# EAGLE design Controller (EAGLE 7.2.0)
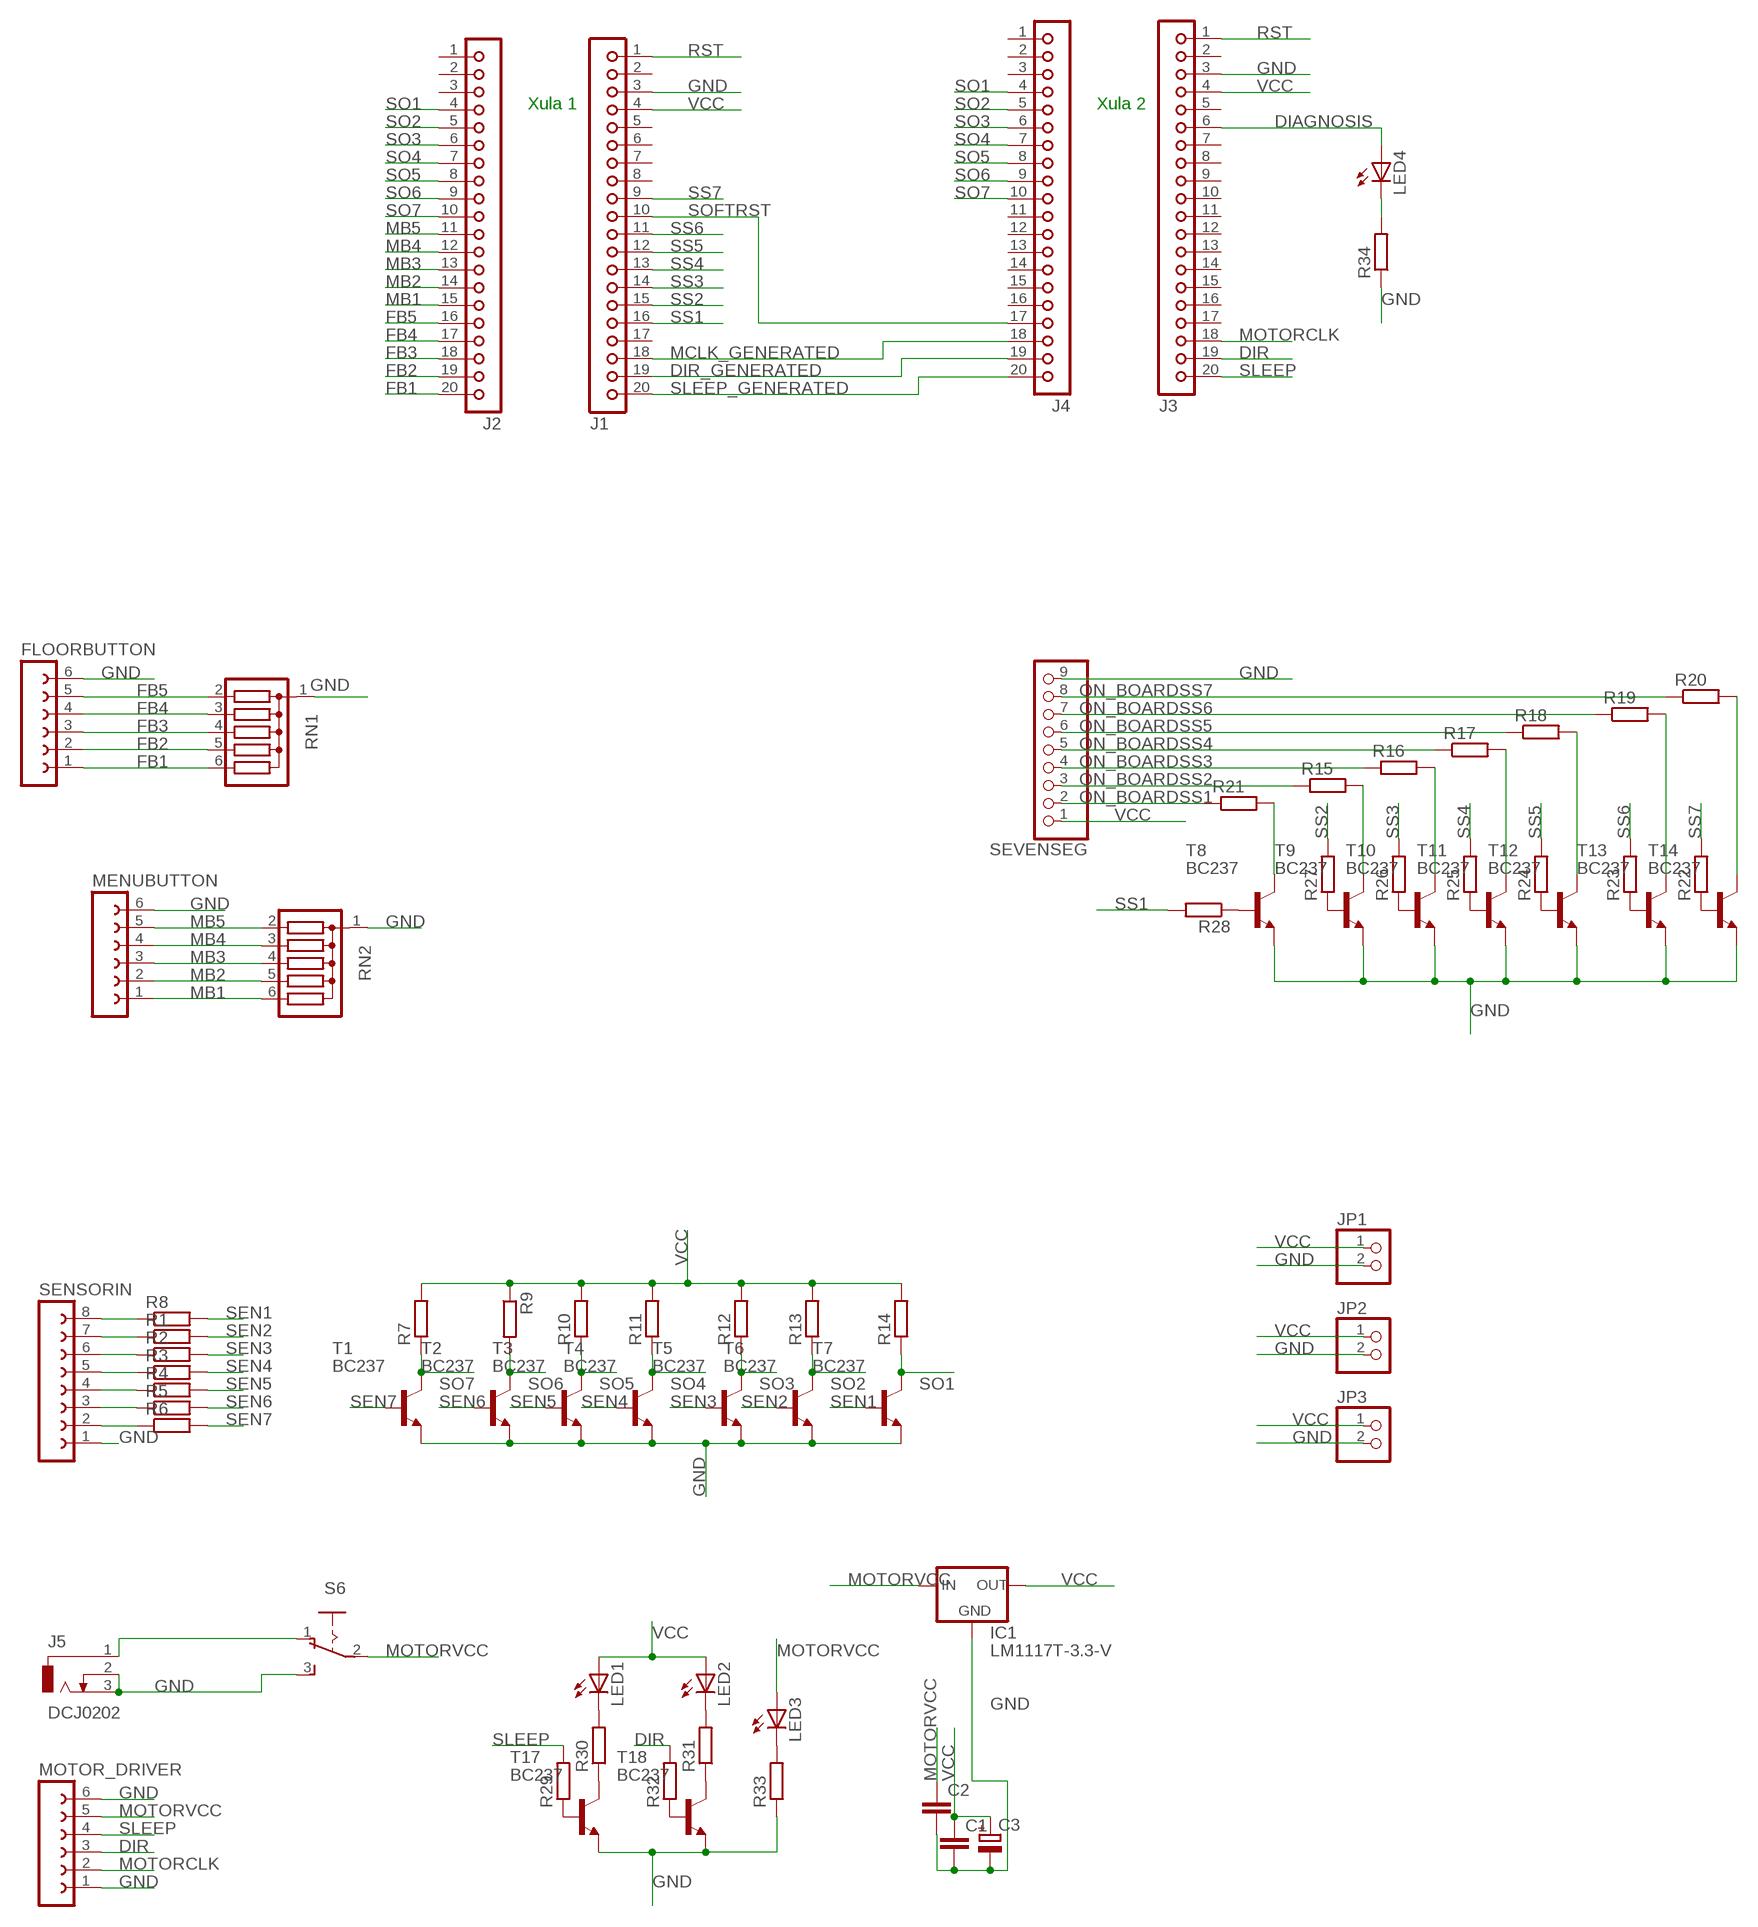
[diagram p0: schematic, sheet 1]

## Parts
C1  C-EU025-025X050  [C025-025X050]
C2  C-EU025-025X050  [C025-025X050]
C3  CPOL-EUE3.5-8  [E3,5-8]
FLOORBUTTON  FE06-1  [FE06]
IC1  LM1117T-3.3-V  [TO220V]
J1  JBK20  [JBK20]
J2  JBK20  [JBK20]
J3  JBK20  [JBK20]
J4  JBK20  [JBK20]
J5  DCJ0202  [DCJ0202]
JP1  PINHD-1X2  [1X02]
JP2  PINHD-1X2  [1X02]
JP3  PINHD-1X2  [1X02]
LED1  LED3MM  [LED3MM]
LED2  LED3MM  [LED3MM]
LED3  LED3MM  [LED3MM]
LED4  LED3MM  [LED3MM]
MENUBUTTON  FE06-1  [FE06]
MOTOR_DRIVER  FE06-1  [FE06]
R1  R-EU_0204/5  [0204/5]
R2  R-EU_0204/5  [0204/5]
R3  R-EU_0204/5  [0204/5]
R4  R-EU_0204/5  [0204/5]
R5  R-EU_0204/5  [0204/5]
R6  R-EU_0204/5  [0204/5]
R7  R-EU_0204/5  [0204/5]
R8  R-EU_0204/5  [0204/5]
R9  R-EU_0204/5  [0204/5]
R10  R-EU_0204/5  [0204/5]
R11  R-EU_0204/5  [0204/5]
R12  R-EU_0204/5  [0204/5]
R13  R-EU_0204/5  [0204/5]
R14  R-EU_0204/5  [0204/5]
R15  R-EU_0204/5  [0204/5]
R16  R-EU_0204/5  [0204/5]
R17  R-EU_0204/5  [0204/5]
R18  R-EU_0204/5  [0204/5]
R19  R-EU_0204/5  [0204/5]
R20  R-EU_0204/5  [0204/5]
R21  R-EU_0204/5  [0204/5]
R22  R-EU_0204/5  [0204/5]
R23  R-EU_0204/5  [0204/5]
R24  R-EU_0204/5  [0204/5]
R25  R-EU_0204/5  [0204/5]
R26  R-EU_0204/5  [0204/5]
R27  R-EU_0204/5  [0204/5]
R28  R-EU_0204/5  [0204/5]
R29  R-EU_0204/5  [0204/5]
R30  R-EU_0204/5  [0204/5]
R31  R-EU_0204/5  [0204/5]
R32  R-EU_0204/5  [0204/5]
R33  R-EU_0204/5  [0204/5]
R34  R-EU_0204/5  [0204/5]
RN1  G05R  [SIL6]
RN2  G05R  [SIL6]
S6  255SB  [255SB]
SENSORIN  FE08-1  [FE08]
SEVENSEG  PINHD-1X9  [1X09-BIG]
T1  BC237  [TO92]
T2  BC237  [TO92]
T3  BC237  [TO92]
T4  BC237  [TO92]
T5  BC237  [TO92]
T6  BC237  [TO92]
T7  BC237  [TO92]
T8  BC237  [TO92]
T9  BC237  [TO92]
T10  BC237  [TO92]
T11  BC237  [TO92]
T12  BC237  [TO92]
T13  BC237  [TO92]
T14  BC237  [TO92]
T17  BC237  [TO92]
T18  BC237  [TO92]

## Nets
DIAGNOSIS: J3.6 LED4.A
DIR: J3.19 MOTOR_DRIVER.3 R32.2
DIR_GENERATED: J1.19 J4.19
FB1: FLOORBUTTON.1 J2.20 RN1.6
FB2: FLOORBUTTON.2 J2.19 RN1.5
FB3: FLOORBUTTON.3 J2.18 RN1.4
FB4: FLOORBUTTON.4 J2.17 RN1.3
FB5: FLOORBUTTON.5 J2.16 RN1.2
GND: C1.2 C2.2 C3.- FLOORBUTTON.6 IC1.1(GND) J1.3 J3.3 J5.2 J5.3 JP1.2 JP2.2 JP3.2 MENUBUTTON.6 MOTOR_DRIVER.1 MOTOR_DRIVER.6 R33.1 R34.1 RN1.1 RN2.1 S6.3(S) SENSORIN.1 SEVENSEG.9 T1.1(E) T2.1(E) T3.1(E) T4.1(E) T5.1(E) T6.1(E) T7.1(E) T8.1(E) T9.1(E) T10.1(E) T11.1(E) T12.1(E) T13.1(E) T14.1(E) T17.1(E) T18.1(E)
MB1: J2.15 MENUBUTTON.1 RN2.6
MB2: J2.14 MENUBUTTON.2 RN2.5
MB3: J2.13 MENUBUTTON.3 RN2.4
MB4: J2.12 MENUBUTTON.4 RN2.3
MB5: J2.11 MENUBUTTON.5 RN2.2
MCLK_GENERATED: J1.18 J4.18
MOTORCLK: J3.18 MOTOR_DRIVER.2
MOTORVCC: C2.1 IC1.3(IN) LED3.A MOTOR_DRIVER.5 S6.2(P)
N$1: R2.1 SENSORIN.6
N$2: R21.2 T8.3(C)
N$3: LED4.K(C) R34.2
N$4: R15.2 T9.3(C)
N$5: R16.2 T10.3(C)
N$6: R17.2 T11.3(C)
N$7: R18.2 T12.3(C)
N$8: R19.2 T13.3(C)
N$9: R5.1 SENSORIN.3
N$10: R4.1 SENSORIN.4
N$11: R3.1 SENSORIN.5
N$12: R1.1 SENSORIN.7
N$13: R8.1 SENSORIN.8
N$14: R20.2 T14.3(C)
N$15: J5.1 S6.1(O)
N$16: R6.1 SENSORIN.2
N$28: R22.1 T14.2(B)
N$29: R23.1 T13.2(B)
N$30: R24.1 T12.2(B)
N$31: R25.1 T11.2(B)
N$32: R26.1 T10.2(B)
N$33: R27.1 T9.2(B)
N$34: R28.1 T8.2(B)
N$35: R29.1 T17.2(B)
N$36: R30.1 T17.3(C)
N$37: R31.1 T18.3(C)
N$38: R32.1 T18.2(B)
N$39: LED3.K(C) R33.2
N$40: LED1.K(C) R30.2
N$41: LED2.K(C) R31.2
ON_BOARDSS1: R21.1 SEVENSEG.2
ON_BOARDSS2: R15.1 SEVENSEG.3
ON_BOARDSS3: R16.1 SEVENSEG.4
ON_BOARDSS4: R17.1 SEVENSEG.5
ON_BOARDSS5: R18.1 SEVENSEG.6
ON_BOARDSS6: R19.1 SEVENSEG.7
ON_BOARDSS7: R20.1 SEVENSEG.8
RST: J1.1 J3.1
SEN1: R8.2 T7.2(B)
SEN2: R1.2 T6.2(B)
SEN3: R2.2 T5.2(B)
SEN4: R3.2 T4.2(B)
SEN5: R4.2 T3.2(B)
SEN6: R5.2 T2.2(B)
SEN7: R6.2 T1.2(B)
SLEEP: J3.20 MOTOR_DRIVER.4 R29.2
SLEEP_GENERATED: J1.20 J4.20
SO1: J2.4 J4.4 R14.1 T7.3(C)
SO2: J2.5 J4.5 R13.1 T6.3(C)
SO3: J2.6 J4.6 R12.1 T5.3(C)
SO4: J2.7 J4.7 R11.1 T4.3(C)
SO5: J2.8 J4.8 R10.1 T3.3(C)
SO6: J2.9 J4.9 R9.2 T2.3(C)
SO7: J2.10 J4.10 R7.1 T1.3(C)
SOFTRST: J1.10 J4.17
SS1: J1.16 R28.2
SS2: J1.15 R27.2
SS3: J1.14 R26.2
SS4: J1.13 R25.2
SS5: J1.12 R24.2
SS6: J1.11 R23.2
SS7: J1.9 R22.2
VCC: C1.1 C3.+ IC1.2(OUT) J1.4 J3.4 JP1.1 JP2.1 JP3.1 LED1.A LED2.A R7.2 R9.1 R10.2 R11.2 R12.2 R13.2 R14.2 SEVENSEG.1
Unconnected: J1.2 J1.5 J1.6 J1.7 J1.8 J1.17 J2.1 J2.2 J2.3 J3.2 J3.5 J3.7 J3.8 J3.9 J3.10 J3.11 J3.12 J3.13 J3.14 J3.15 J3.16 J3.17 J4.1 J4.2 J4.3 J4.11 J4.12 J4.13 J4.14 J4.15 J4.16

## Notes on the sheet
- Xula 1 | Xula 2

## Library data of the parts
C1 C2 = rcl:C-EU: CAPACITOR, European symbol
C3 = rcl:CPOL-EU: POLARIZED CAPACITOR, European symbol
FLOORBUTTON MENUBUTTON MOTOR_DRIVER = con-lsta:FE06-1: FEMALE HEADER; OC_FARNELL: unknown; OC_NEWARK: unknown
IC1 = lm1117:LM1117T-*
J1-J4 = con-lsta:JBK20: PIN HEADER; OC_FARNELL: unknown; OC_NEWARK: unknown
J5 = con-jack:DCJ0202: DC POWER JACK Source: DCJ0202.pdf; OC_FARNELL: unknown; OC_NEWARK: unknown
JP1-JP3 = pinhead:PINHD-1X2: PIN HEADER
LED1-LED4 = led:LED: LED OSRAM: - CHIPLED LG R971, LG N971, LY N971, LG Q971, LY Q971, LO R971, LY R971 LH N974, LH R974 LS Q976, LO Q976, LY Q976 LO Q996 - Hyper CHIPLED LW Q18S LB Q993, LB Q99A, LB R99A - SideLED LS A670, LO A670, LY A670, LG A670, LP A670 LB A673, LV A673, LT A673, LW A673 LH A674 LY A675 LS A676, LA A676, LO A676, LY A676, LW A676 LS A679, LY A679, LG A679 - Hyper Micro SIDELED® LS Y876, LA Y876, LO Y876, LY Y876 LT Y87S - SmartLED LW L88C, LW L88S LB L89C, LB L89S, LG L890 LS L89K, LO L89K, LY L89K LS L896, LA L896, LO L896, LY L896 - TOPLED LS T670, LO T670, LY T670, LG T670, LP T670 LSG T670, LSP T670, LSY T670, LOP T670, LYG T670 LG T671, LOG T671, LSG T671 LB T673, LV T673, LT T673, LW T673 LH T674 LS T676, LA T676, LO T676, LY T676, LB T676, LH T676, LSB T676, LW T676 LB T67C, LV T67C, LT T67C, LS T67K, LO T67K, LY T67K, LW E67C LS E67B, LA E67B, LO E67B, LY E67B, LB E67C, LV E67C, LT E67C LW T67C LS T679, LY T679, LG T679 LS T770, LO T770, LY T770, LG T770, LP T770 LB T773, LV T773, LT T773, LW T773 LH T774 LS E675, LA E675, LY E675, LS T675 LS T776, LA T776, LO T776, LY T776, LB T776 LHGB T686 LT T68C, LB T68C - Hyper Mini TOPLED® LB M676 - Mini TOPLED Santana® LG M470 LS M47K, LO M47K, LY M47K Source: http://www.osram.convergy.de LUXEON: - LUMILED® LXK2-PW12-R00, LXK2-PW12-S00, LXK2-PW14-U00, LXK2-PW14-V00 LXK2-PM12-R00, LXK2-PM12-S00, LXK2-PM14-U00 LXK2-PE12-Q00, LXK2-PE12-R00, LXK2-PE12-S00, LXK2-PE14-T00, LXK2-PE14-U00 LXK2-PB12-K00, LXK2-PB12-L00, LXK2-PB12-M00, LXK2-PB14-N00, LXK2-PB14-P00, LXK2-PB14-Q00 LXK2-PR12-L00, LXK2-PR12-M00, LXK2-PR14-Q00, LXK2-PR14-R00 LXK2-PD12-Q00, LXK2-PD12-R00, LXK2-PD12-S00 LXK2-PH12-R00, LXK2-PH12-S00 LXK2-PL12-P00, LXK2-PL12-Q00, LXK2-PL12-R00 Source: www.luxeon.com KINGBRIGHT: KA-3528ASYC Source: www.kingbright.com
R1-R34 = rcl:R-EU_: RESISTOR, European symbol
RN1 RN2 = resistor-sil:G05R: SIL RESISTOR; OC_FARNELL: unknown; OC_NEWARK: unknown
S6 = switch:255SB: SLIDING SWITCH Distributor Buerklin, 11G810
SENSORIN = con-lsta:FE08-1: FEMALE HEADER; OC_FARNELL: unknown; OC_NEWARK: unknown
SEVENSEG = adafruit:PINHD-1X9: Pin header 1x10 0.1" spacing With round pins
T1-T14 T17 T18 = transistor-neu-to92:BC237: NPN TRANSISTOR

## Net classes
0 default: clearance 0.205 mm

## Board
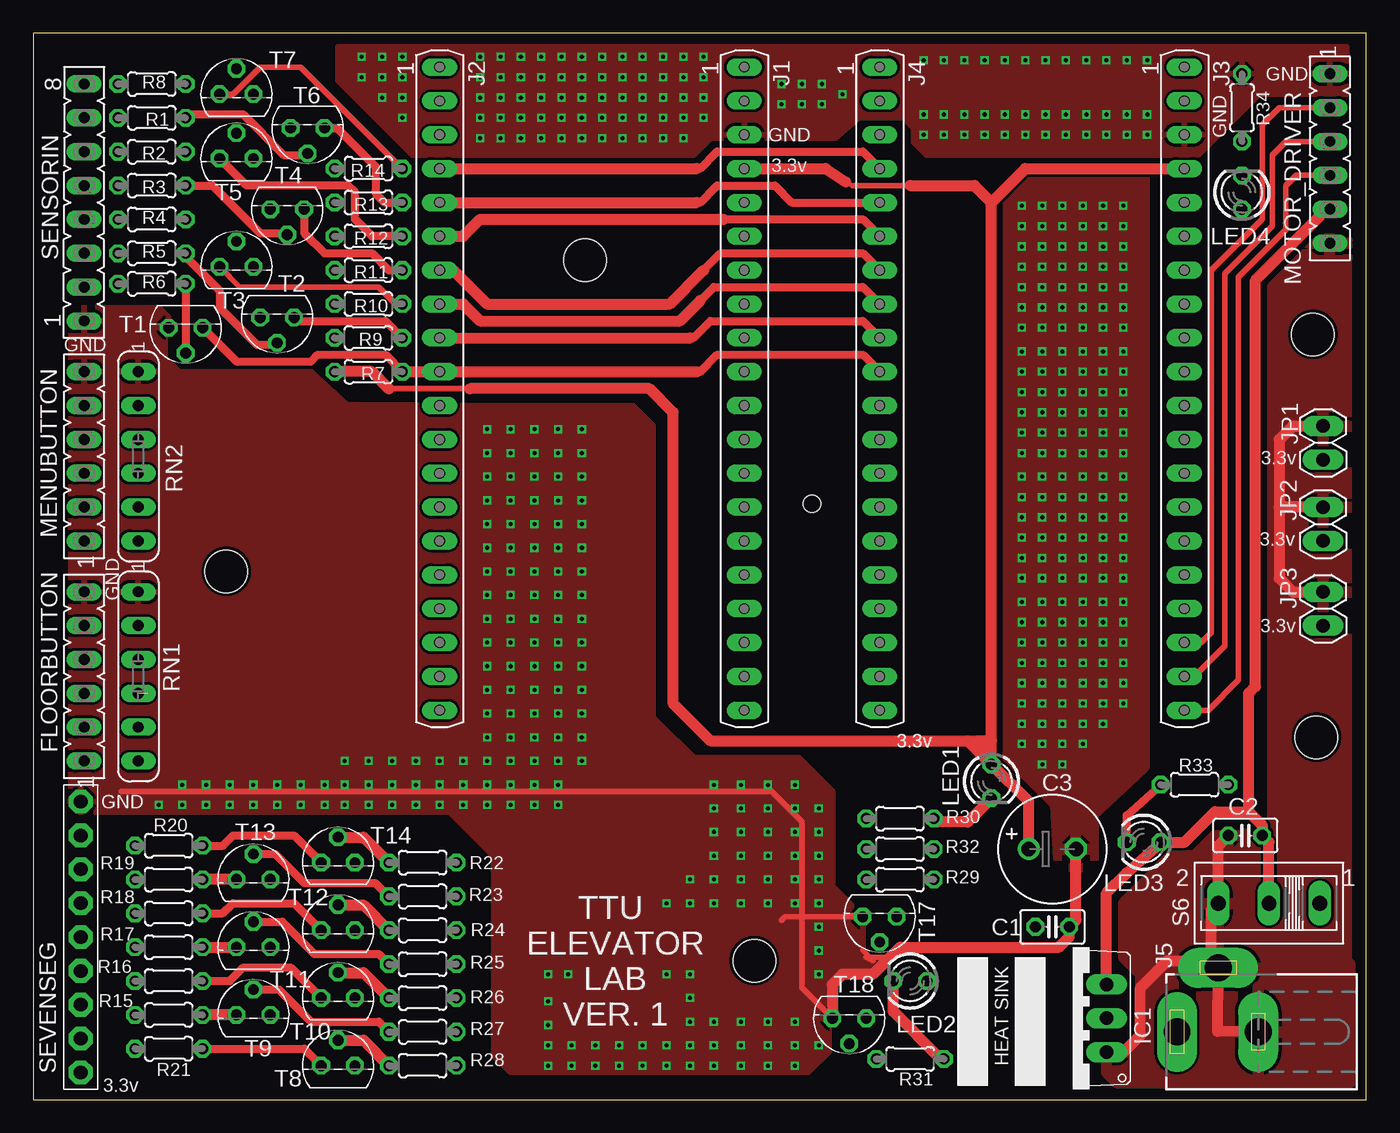
[diagram p1: board, top side]
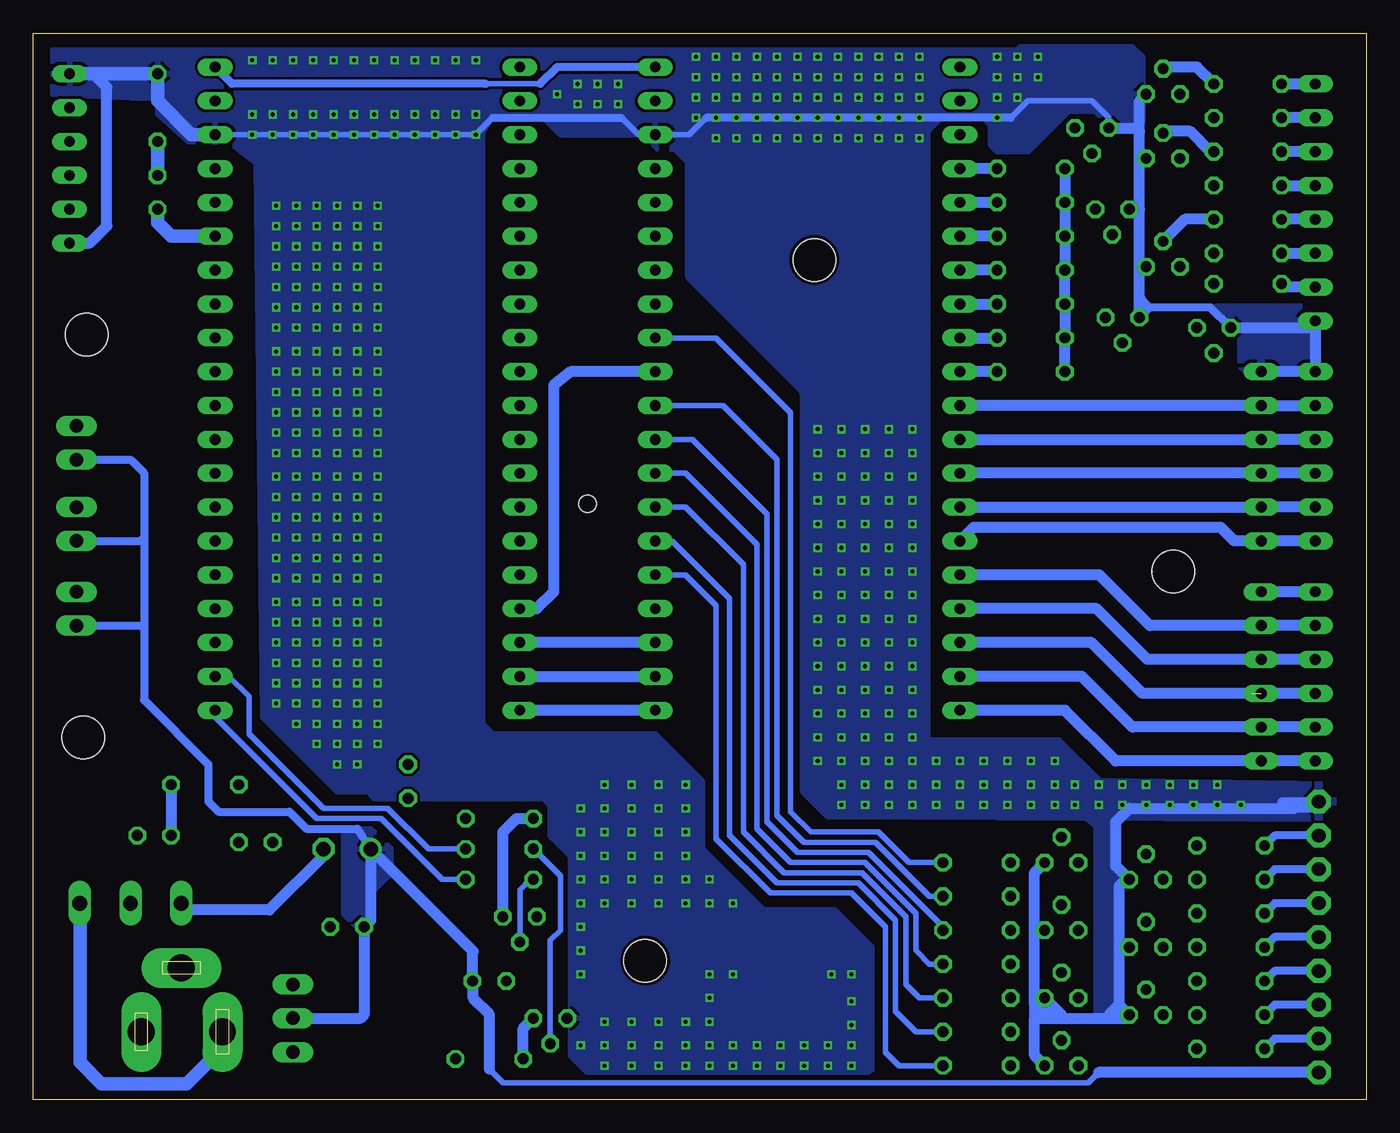
[diagram p2: board, bottom side, seen from below]

Size 100 x 80 mm. Coordinates in mm from the lower left corner, seen from the top.
Outline: 0,0 100,0 100,80 0,80 0,0
Copper layers (1*16): Top 0.035mm / dielectric 1.5mm / Bottom 0.035mm
Design rules "SeeedStudio_2layer_DRU_no_angle_20140221": minimum track width 6mil, minimum drill 12mil, track to track 6mil, track to pad 6mil, pad to pad 6mil, via to via 6mil, smd to smd 0mil, copper to edge 10mil, drill to drill 10mil, minimum pad ring 10mil, minimum via ring 6mil, stop-mask expansion 2mil, vias tented up to drill 100mil, thermal gap 10mil
Holes 3.2 mm at 96.01,57.4 96.27,27.18 14.48,39.62 41.4,62.99 54.1,10.41
Holes 1.3 mm at 58.42,44.7

### Footprints (pad centres in the part's own frame; a part is rotated, then mirrored left to right if it is on the bottom)
C025-025X050 = drill 0.813 octagon: 1 -1.27,0; 2 1.27,0
E3,5-8 = drill 1.1 pad 1.6: + -1.778,0 | drill 1.1 pad 1.6 octagon: - 1.778,0
FE06 = drill 0.813 long: 1 -6.35,0; 2 -3.81,0; 3 -1.27,0; 4 1.27,0; 5 3.81,0; 6 6.35,0
TO220V = drill 1.016 long: 1 -2.54,-2.54; 2 0,-2.54; 3 2.54,-2.54
JBK20 = drill 0.813 long: 1 -24.13,0; 2 -21.59,0; 3 -19.05,0; 4 -16.51,0; 5 -13.97,0; 6 -11.43,0; 7 -8.89,0; 8 -6.35,0; 9 -3.81,0; 10 -1.27,0; 11 1.27,0; 12 3.81,0; 13 6.35,0; 14 8.89,0; 15 11.43,0; 16 13.97,0; 17 16.51,0; 18 19.05,0; 19 21.59,0; 20 24.13,0
DCJ0202 = drill 2 pad 2 long: 1 0,3.1; 2 4.8,0; 3 0,-3
1X02 = drill 1.016 long: 1 -1.27,0; 2 1.27,0
LED3MM = drill 0.813 octagon: A -1.27,0; K 1.27,0
0204/5 = drill 0.813 octagon: 1 -2.54,0; 2 2.54,0
SIL6 = drill 0.813 long: 1 -6.35,0; 2 -3.81,0; 3 -1.27,0; 4 1.27,0; 5 3.81,0; 6 6.35,0
255SB = drill 1.118 long: 1 -3.81,0; 2 0,0; 3 3.81,0
FE08 = drill 0.813 long: 1 -8.89,0; 2 -6.35,0; 3 -3.81,0; 4 -1.27,0; 5 1.27,0; 6 3.81,0; 7 6.35,0; 8 8.89,0
1X09-BIG = drill 1.016 pad 1.778 octagon: 1 -10.16,0; 2 -7.62,0; 3 -5.08,0; 4 -2.54,0; 5 0,0; 6 2.54,0; 7 5.08,0; 8 7.62,0; 9 10.16,0
TO92 = drill 0.813 octagon: 1 1.27,0; 2 0,1.905; 3 -1.27,0

### Placement (x,y rotation side)
C1  76.45,12.95 0 top
C2  90.93,19.81 180 top
C3  76.45,18.8 0 top
FLOORBUTTON  3.81,31.75 90 top
IC1  77.98,6.1 90 top
J1  53.34,53.34 270 top
J2  30.48,53.34 270 top
J3  86.36,53.34 270 top
J4  63.5,53.34 270 top
J5  88.9,5.08 90 top
JP1  96.77,49.28 90 top
JP2  96.77,43.18 90 top
JP3  96.77,36.83 90 top
LED1  71.88,23.88 270 top
LED2  65.79,8.89 180 top
LED3  83.31,19.3 180 top
LED4  90.68,68.07 90 top
MENUBUTTON  3.81,48.26 90 top
MOTOR_DRIVER  97.28,70.61 270 top
R1  8.89,73.66 0 top
R2  8.89,71.12 0 top
R3  8.89,68.58 0 top
R4  8.89,66.04 0 top
R5  8.89,63.5 0 top
R6  8.89,61.21 0 top
R7  25.15,54.61 180 top
R8  8.89,76.2 0 top
R9  25.15,57.15 0 top
R10  25.15,59.69 180 top
R11  25.15,62.23 180 top
R12  25.15,64.77 180 top
R13  25.15,67.31 180 top
R14  25.15,69.85 180 top
R15  10.16,6.35 0 top
R16  10.16,8.89 0 top
R17  10.16,11.43 0 top
R18  10.16,13.97 0 top
R19  10.16,16.51 0 top
R20  10.16,19.05 0 top
R21  10.16,3.81 0 top
R22  29.21,17.78 0 top
R23  29.21,15.24 0 top
R24  29.21,12.7 0 top
R25  29.21,10.16 0 top
R26  29.21,7.62 0 top
R27  29.21,5.08 0 top
R28  29.21,2.54 0 top
R29  65.02,16.51 0 top
R30  65.02,21.08 0 top
R31  65.79,3.05 0 top
R32  65.02,18.8 0 top
R33  87.12,23.62 180 top
R34  90.68,74.42 270 top
RN1  7.87,31.75 270 top
RN2  7.87,48.26 270 top
S6  92.71,14.73 180 top
SENSORIN  3.81,67.31 90 top
SEVENSEG  3.56,12.19 90 top
T1  11.43,57.91 180 top
T2  18.29,58.67 180 top
T3  15.24,62.48 0 top
T4  19.05,66.8 180 top
T5  15.24,70.61 0 top
T6  20.57,72.9 180 top
T7  15.24,75.44 0 top
T8  22.86,2.54 0 top
T9  16.51,6.35 0 top
T10  22.86,7.62 0 top
T11  16.51,11.43 0 top
T12  22.86,12.7 0 top
T13  16.51,16.51 0 top
T14  22.86,17.78 0 top
T17  63.5,13.72 180 top
T18  61.21,6.1 180 top

### Tracks (layer width: path | path; a pad name or v marks a point on that pad's centre or on a via)
DIAGNOSIS
  Bottom 1.016: LED4.A 90.68,65.79 89.66,64.77 J3.6
DIR
  Top 0.406: J3.19 87.12,31.75 89.41,34.04 89.41,61.98 92.96,65.53 92.96,70.87 93.98,71.88 MOTOR_DRIVER.3
  Bottom 0.406: R32.2 70.36,18.8 73.41,21.84 78.23,21.84 83.82,27.43 83.82,30.23 85.34,31.75 J3.19
DIR_GENERATED
  Bottom 0.813: J4.19 J1.19
FB1
  Bottom 0.813: FLOORBUTTON.1 RN1.6 18.8,25.4 22.61,29.21 J2.20
FB2
  Bottom 0.813: FLOORBUTTON.2 RN1.5 17.53,27.94 21.34,31.75 J2.19
FB3  (1 unrouted)
  Bottom 0.813: FLOORBUTTON.3 RN1.4 | RN1.4 8.64,30.48 | RN1.4 16.8,30.48 20.61,34.29 J2.18
FB4
  Bottom 0.813: FLOORBUTTON.4 RN1.3 16.43,33.02 20.24,36.83 J2.17
FB5
  Bottom 0.813: FLOORBUTTON.5 RN1.2 16.22,35.56 20.03,39.37 J2.16
GND  (via drill 0.3)
  Top 0.406: 62.23,11.18 62.99,10.41 62.48,10.67 64.26,10.67 | 6.6,23.11 55.37,23.11 57.66,20.83 57.66,8.38 T18.1 | T17.1 56.39,13.72 56.13,13.46
  Top 0.813: J5.3 88.85,5.1 J5.2 88.37,10.41 | C2.2 88.9,19.05 S6.3 88.37,14.2 88.37,10.41 | T18.1 59.94,8.64 60.71,9.4 62.99,9.4 64.26,10.67 65.02,11.43 76.96,11.43 77.72,12.19 C1.2 78.23,13.46 C3.- | IC1.1 81.79,3.56 83.06,4.83 83.06,8.38 85.09,10.41 88.37,10.41 | 93.47,44.45 93.47,49.53 94.49,50.55 JP1.2 | 93.47,44.45 93.47,39.12 94.49,38.1 JP3.2 | JP2.2 93.47,44.45
  Bottom 0.406: 65.53,73.66 v66.8,72.39 J3.3 | 55.88,73.66 54.61,72.39 J1.3 50.8,72.39 49.53,73.66 | T6.1 19.3,73.66 20.57,74.93 25.4,74.93 26.67,73.66
  Bottom 0.61: T1.1 11.68,59.44 16.26,59.44 | 16.26,59.44 T2.1 | 65.53,73.66 55.88,73.66 | 26.67,73.66 49.53,73.66 | 16.26,59.44 17.02,60.2 | 6.35,22.35 SEVENSEG.9 4.06,21.84 6.35,21.84
  Bottom 0.813: FLOORBUTTON.6 RN1.1 | RN2.1 MENUBUTTON.6 SENSORIN.1 4.32,57.91 T1.1 | 18.54,11.43 18.54,16 18.03,16.51 T13.1 18.8,17.53 18.8,20.83 17.78,21.84 6.35,21.84 5.33,21.84 | 18.54,11.43 18.54,7.11 | T11.1 18.54,11.43 | T8.1 24.89,3.3 24.89,6.1 | 24.89,7.11 24.89,7.37 | 24.89,7.37 24.89,12.45 | 24.89,12.45 24.89,17.02 T14.1 | T12.1 24.64,12.7 24.89,12.45 | 24.38,7.62 24.64,7.62 24.89,7.37 | T9.1 19.3,6.35 18.54,7.11 | 24.38,7.62 24.89,7.11 | 24.89,7.11 24.89,6.1 | 24.89,6.1 18.03,6.1 T9.1 | T9.1 18.54,7.11 | 24.38,6.35 24.38,7.11 23.62,6.35 22.86,6.35 T10.1 24.38,7.62 | T2.1 17.02,60.2 17.02,62.48 | 17.02,62.48 17.02,66.8 | 17.02,66.8 17.02,70.61 | 17.02,70.61 17.02,72.64 | 17.02,72.64 17.02,74.93 T7.1 | T5.1 17.02,70.61 | T4.1 17.02,66.8 | T3.1 17.02,62.48 | T6.1 17.27,72.9 17.02,72.64 | R33.1 C2.2 | C3.- 78.23,18.29 82.3,14.22 88.39,14.22 S6.3 | MOTOR_DRIVER.6 95.76,64.26 94.49,65.53 94.49,75.95 95.5,76.96
  Bottom 1.016: J3.3 88.14,72.39 90.68,74.93 R34.1 95.5,76.96 MOTOR_DRIVER.1
  other vias: 80.26,65.53 81.79,65.53 78.74,65.53 77.22,65.53 75.69,65.53 74.17,65.53 81.79,62.48 80.26,62.48 78.74,62.48 77.22,62.48 75.69,62.48 74.17,62.48 80.26,64.01 81.79,64.01 78.74,64.01 77.22,64.01 75.69,64.01 74.17,64.01 34.04,50.29 35.81,50.29 37.59,50.29 39.37,50.29 41.15,50.29 34.04,23.62 35.81,23.62 37.59,23.62 39.37,23.62 51.05,23.62 53.09,23.62 55.12,23.62 57.15,23.62 51.05,21.84 53.09,21.84 55.12,21.84 57.15,21.84 58.93,21.84 58.93,20.07 57.15,20.07 55.12,20.07 53.09,20.07 51.05,20.07 51.05,18.29 53.09,18.29 55.12,18.29 57.15,18.29 58.93,18.29 58.93,16.51 57.15,16.51 55.12,16.51 53.09,16.51 51.05,16.51 58.93,14.73 58.93,12.95 57.15,14.73 58.93,11.18 58.93,9.4 55.12,14.73 53.09,14.73 51.05,14.73 34.04,48.51 35.81,48.51 37.59,48.51 39.37,48.51 41.15,48.51 34.04,46.74 35.81,46.74 37.59,46.74 39.37,46.74 41.15,46.74 34.04,44.96 35.81,44.96 37.59,44.96 39.37,44.96 41.15,44.96 34.04,43.18 35.81,43.18 37.59,43.18 39.37,43.18 41.15,43.18 34.04,41.4 35.81,41.4 37.59,41.4 39.37,41.4 41.15,41.4 34.04,39.62 35.81,39.62 37.59,39.62 39.37,39.62 41.15,39.62 34.04,25.4 35.81,25.4 37.59,25.4 39.37,25.4 41.15,25.4 34.04,27.18 35.81,27.18 37.59,27.18 39.37,27.18 41.15,27.18 34.04,28.96 35.81,28.96 37.59,28.96 39.37,28.96 41.15,28.96 34.04,30.73 35.81,30.73 37.59,30.73 39.37,30.73 41.15,30.73 34.04,32.51 35.81,32.51 37.59,32.51 39.37,32.51 41.15,32.51 34.04,36.07 35.81,36.07 37.59,36.07 39.37,36.07 41.15,36.07 34.04,37.85 35.81,37.85 37.59,37.85 39.37,37.85 41.15,37.85 34.04,34.29 35.81,34.29 37.59,34.29 39.37,34.29 41.15,34.29 32.26,22.1 34.04,22.1 35.81,22.1 37.59,22.1 39.37,22.1 32.26,23.62 23.37,23.62 25.15,23.62 26.92,23.62 28.7,23.62 30.48,23.62 30.48,22.1 28.7,22.1 26.92,22.1 25.15,22.1 23.37,22.1 53.09,5.84 55.12,5.84 57.15,5.84 57.15,4.06 55.12,4.06 53.09,4.06 57.15,2.54 55.12,2.54 53.09,2.54 51.05,5.84 51.05,4.06 51.05,2.54 49.28,4.06 47.5,4.06 45.72,4.06 43.94,4.06 42.16,4.06 40.39,4.06 38.61,4.06 38.61,5.59 38.61,2.54 40.39,2.54 42.16,2.54 43.94,2.54 45.72,2.54 47.5,2.54 49.28,2.54 49.28,5.84 49.28,7.62 49.28,16.51 49.28,14.73 47.5,14.73 49.28,9.4 47.5,9.4 38.61,7.37 38.61,9.4 40.13,9.4 32.26,25.4 30.48,25.4 28.7,25.4 26.92,25.4 25.15,25.4 23.37,25.4 21.84,23.62 21.84,22.1 58.93,4.06 81.79,29.72 80.26,29.72 78.74,29.72 77.22,29.72 75.69,29.72 74.17,29.72 80.26,28.19 78.74,28.19 77.22,28.19 75.69,28.19 74.17,28.19 74.17,26.67 75.69,26.67 77.22,26.67 78.74,26.67 77.22,25.15 75.69,25.15 74.17,67.06 80.26,31.24 81.79,31.24 78.74,31.24 77.22,31.24 75.69,31.24 74.17,31.24 80.26,32.77 81.79,32.77 78.74,32.77 77.22,32.77 75.69,32.77 74.17,32.77 81.79,34.29 80.26,34.29 78.74,34.29 77.22,34.29 75.69,34.29 74.17,34.29 80.26,35.81 81.79,35.81 78.74,35.81 77.22,35.81 75.69,35.81 74.17,35.81 80.26,37.34 81.79,37.34 78.74,37.34 77.22,37.34 75.69,37.34 74.17,37.34 81.79,39.12 80.26,39.12 78.74,39.12 77.22,39.12 75.69,39.12 74.17,39.12 80.26,40.64 81.79,40.64 78.74,40.64 77.22,40.64 75.69,40.64 74.17,40.64 80.26,42.16 81.79,42.16 78.74,42.16 77.22,42.16 75.69,42.16 74.17,42.16 81.79,43.69 80.26,43.69 78.74,43.69 77.22,43.69 75.69,43.69 74.17,43.69 80.26,45.21 81.79,45.21 78.74,45.21 77.22,45.21 75.69,45.21 74.17,45.21 80.26,46.74 81.79,46.74 78.74,46.74 77.22,46.74 75.69,46.74 74.17,46.74 81.79,48.51 80.26,48.51 78.74,48.51 77.22,48.51 75.69,48.51 74.17,48.51 80.26,50.04 81.79,50.04 78.74,50.04 77.22,50.04 75.69,50.04 74.17,50.04 80.26,51.56 81.79,51.56 78.74,51.56 77.22,51.56 75.69,51.56 74.17,51.56 81.79,53.09 80.26,53.09 78.74,53.09 77.22,53.09 75.69,53.09 74.17,53.09 80.26,54.61 81.79,54.61 78.74,54.61 77.22,54.61 75.69,54.61 74.17,54.61 80.26,56.13 81.79,56.13 78.74,56.13 77.22,56.13 75.69,56.13 74.17,56.13 81.79,57.91 80.26,57.91 78.74,57.91 77.22,57.91 75.69,57.91 74.17,57.91 80.26,59.44 81.79,59.44 78.74,59.44 77.22,59.44 75.69,59.44 74.17,59.44 80.26,60.96 81.79,60.96 78.74,60.96 77.22,60.96 75.69,60.96 74.17,60.96 75.69,67.06 77.22,67.06 78.74,67.06 80.26,67.06 81.79,67.06 82.04,72.39 80.52,72.39 78.99,72.39 77.47,72.39 75.95,72.39 74.42,72.39 72.9,72.39 71.37,72.39 69.85,72.39 68.33,72.39 83.57,72.39 77.47,73.91 78.99,73.91 80.52,73.91 82.04,73.91 83.57,73.91 75.95,73.91 74.42,73.91 72.9,73.91 71.37,73.91 69.85,73.91 68.33,73.91 66.8,73.91 68.33,77.98 66.8,77.98 69.85,77.98 71.37,77.98 72.9,77.98 74.42,77.98 75.95,77.98 77.47,77.98 78.99,77.98 80.52,77.98 82.04,77.98 83.57,77.98 33.53,78.23 35.05,78.23 36.58,78.23 38.1,78.23 39.62,78.23 41.15,78.23 42.67,78.23 44.2,78.23 45.72,78.23 47.24,78.23 48.77,78.23 50.29,78.23 27.69,78.23 26.16,78.23 24.64,78.23 24.64,76.71 26.16,76.71 27.69,76.71 27.69,75.18 26.16,75.18 27.69,73.66 33.53,73.66 35.05,73.66 36.58,73.66 38.1,73.66 39.62,73.66 41.15,73.66 42.67,73.66 44.2,73.66 45.72,73.66 47.24,73.66 48.77,73.66 50.29,73.66 33.53,72.14 35.05,72.14 36.58,72.14 38.1,72.14 39.62,72.14 41.15,72.14 42.67,72.14 44.2,72.14 45.72,72.14 47.24,72.14 48.77,72.14 56.13,76.2 57.66,76.2 59.18,76.2 59.18,74.68 57.66,74.68 56.13,74.68 60.71,75.44 33.53,75.18 35.05,75.18 36.58,75.18 38.1,75.18 39.62,75.18 41.15,75.18 42.67,75.18 44.2,75.18 45.72,75.18 47.24,75.18 48.77,75.18 50.29,75.18 33.53,76.71 35.05,76.71 36.58,76.71 38.1,76.71 39.62,76.71 41.15,76.71 42.67,76.71 44.2,76.71 45.72,76.71 47.24,76.71 48.77,76.71 50.29,76.71 20.07,22.1 18.29,22.1 16.51,22.1 14.73,22.1 12.95,22.1 11.18,22.1 9.4,22.1 11.18,23.62 12.95,23.62 14.73,23.62 16.51,23.62 18.29,23.62 20.07,23.62
  pour Bottom: 57.15,7.11 57.15,18.29 61.72,22.86 74.42,22.86 74.93,23.37 77.22,23.37 82.8,28.96 83.31,73.66 82.3,74.68 67.56,74.68 66.29,73.41 66.29,28.19 65.53,27.43 53.34,27.43 50.8,24.89 50.8,11.94 56.64,6.1 59.69,6.1
  pour Top: 3.3,21.59 31.24,21.59 34.54,18.29 34.54,3.3 35.81,2.03 58.17,2.03 59.69,3.56 59.69,6.35 57.66,8.38 57.66,20.83 55.37,23.11 3.3,23.11
  pour Top: 2.79,21.59 2.79,52.32 33.02,52.07 33.53,44.2 33.27,26.67 33.53,25.65 36.83,22.35 9.4,22.35 8.64,21.59
  pour Bottom: 3.81,58.42 4.83,59.44 11.18,59.44 11.43,59.18 10.16,57.91 9.4,57.15 9.4,55.12 8.89,54.61 3.81,54.61
  pour Bottom: 16.76,75.44 16.76,78.23 17.53,78.99 19.56,78.99 25.91,78.99 28.7,76.2 28.7,73.66 28.19,73.15 28.19,71.63 27.69,71.12 25.4,71.12 22.35,74.17 21.34,74.17 20.32,74.17 19.56,73.41 19.56,72.9 17.27,72.9 16.76,73.41
  pour Bottom: 32,73.66 33.02,72.64 33.02,26.92 23.11,26.92 20.07,23.88 2.54,23.62 2.54,21.08 40.39,21.34 42.16,23.11 42.16,53.09 50.8,61.72 50.8,70.36 51.82,71.37 53.09,71.37 53.34,71.63 53.34,72.39 52.58,73.15 50.29,73.15 49.78,73.66
  pour Bottom: 65.53,73.66 66.8,74.93 82.8,75.18 85.6,72.39 86.11,72.39 83.06,70.1 68.07,71.12
  pour Bottom: 59.69,3.3 59.69,18.29 61.21,19.81 61.21,25.91 59.94,27.18 53.09,27.18 49.78,23.88 49.78,18.8 45.21,14.22 39.88,14.22 37.08,11.43 37.08,2.29 37.34,2.03 58.42,2.03
  pour Top: 4.06,38.35 4.06,39.62 4.83,40.39 12.7,40.39 13.46,39.62 13.46,37.59 12.95,37.08 5.33,37.08
  pour Top: 2.79,54.61 2.79,52.07 11.94,52.07 12.7,52.83 12.7,54.1 12.45,54.36 11.18,54.36 9.91,55.63 9.91,57.66 10.16,57.91 10.16,58.67 9.4,59.44 3.56,59.44 2.79,58.67 2.79,55.12 3.3,54.61
  pour Top: 7.87,54.61 20.83,54.61 23.62,52.07 11.68,52.07 9.65,53.85 9.4,54.1 8.38,54.1
  pour Bottom: 53.59,72.39 60.45,72.39 61.72,73.66 60.71,74.68 60.71,75.95 59.94,76.71 56.64,76.71 55.63,75.69 55.63,73.66 54.86,72.9 54.1,72.9
  pour Top: 62.23,9.65 62.23,13.72 59.94,16 59.94,23.11 57.4,25.65 49.53,25.65 46.99,28.19 46.48,28.7 46.48,50.55 44.96,52.07 33.02,52.07 33.02,27.18 32,26.16 29.21,26.16 29.21,23.11 32,23.11 35.31,19.81 55.37,19.81 55.37,5.84 59.44,5.84 59.94,6.1 59.94,8.64 60.71,9.4 62.23,9.4
  pour Top: 61.72,10.41 64.01,10.41 62.99,9.4 61.72,9.4
  pour Top: 60.2,72.14 50.8,72.14 49.53,70.87 28.45,70.87 22.86,76.45 22.86,78.99 98.55,78.99 98.55,75.44 91.95,75.44 87.38,70.87 67.06,70.87 66.04,71.88 66.04,72.9 65.28,73.66 61.98,73.66
  pour Bottom: 25.65,78.74 98.55,78.74 98.55,75.44 92.71,75.18 90.68,75.18 90.68,73.91 88.39,71.88 78.74,71.63 66.8,71.63 65.79,73.41 65.53,73.66 56.13,73.66 53.59,72.14 33.27,72.14 32,73.66 25.4,73.66 25.4,78.23
  pour Bottom: 57.15,6.86 57.15,18.03 61.72,22.61 74.42,22.61 74.93,23.11 77.22,23.11 82.8,28.7 83.31,73.41 82.3,74.42 67.56,74.42 66.29,73.15 66.29,27.94 65.53,27.18 53.34,27.18 50.8,24.64 50.55,9.91 56.39,4.06 59.69,5.84
  pour Top: 73.15,68.58 74.42,69.85 83.31,69.85 83.31,24.89 79.5,21.34 79.5,18.03 78.23,17.27 76.96,18.03 76.71,22.1 73.15,25.65
  pour Top: 80.52,3.56 80.52,2.03 81.28,1.27 98.81,1.27 98.81,10.16 98.04,10.92 92.71,10.92 95,14.22 95,20.07 88.65,19.81 87.12,18.29 85.34,18.29 81.79,14.73 81.79,10.67 83.06,9.4 83.06,4.83 81.53,3.3 80.77,3.3
  pour Bottom: 18.29,21.34 18.8,20.83 18.8,6.35 19.05,6.1 19.81,6.1 20.07,6.6 20.07,20.57 21.84,22.1 19.05,22.1
  pour Top: 98.55,9.91 98.55,64.52 96.52,64.52 92.96,60.96 92.96,12.95 91.69,11.68 93.73,9.65 98.3,9.65
MB1
  Bottom 0.813: MENUBUTTON.1 RN2.6 9.91,41.91 10.92,42.93 29.46,42.93 J2.15
MB2
  Bottom 0.813: MENUBUTTON.2 RN2.5 J2.14
MB3
  Bottom 0.813: MENUBUTTON.3 RN2.4 J2.13
MB4
  Bottom 0.813: MENUBUTTON.4 RN2.3 J2.12
MB5
  Bottom 0.813: J2.11 RN2.2 MENUBUTTON.5
MCLK_GENERATED
  Bottom 0.813: J1.18 J4.18
MOTORCLK
  Top 0.406: J3.18 87.63,34.29 88.39,35.05 88.39,62.23 92.2,66.04 92.2,73.15 93.47,74.42 MOTOR_DRIVER.2
MOTORVCC
  Top 0.813: 91.19,21.59 88.65,21.59 86.36,19.3 LED3.A 82.04,17.02 80.52,15.49 IC1.3 | 91.19,21.59 92.2,20.57 C2.1 92.71,19.3 S6.2 | 91.19,21.59 91.19,30.48 91.69,30.99 91.69,61.47 96.52,66.29 96.52,66.8 MOTOR_DRIVER.5
N$1
  Bottom 0.813: SENSORIN.6 R2.1
N$2
  Top 0.61: R21.2 20.32,3.81 T8.3
N$3
  Bottom 1.016: R34.2 LED4.K
N$4
  Top 0.813: T9.3 R15.2
N$5
  Top 0.61: R16.2 14.73,8.89 15.75,9.91 19.3,9.91 T10.3
N$6
  Top 0.813: R17.2 T11.3
N$7
  Top 0.61: R18.2 14.22,13.97 14.99,14.73 19.56,14.73 T12.3
N$8
  Top 0.813: T13.3 R19.2
N$9
  Bottom 0.813: R5.1 SENSORIN.3
N$10
  Bottom 0.813: SENSORIN.4 R4.1
N$11
  Bottom 0.813: R3.1 SENSORIN.5
N$12
  Bottom 0.813: SENSORIN.7 R1.1
N$13
  Bottom 0.813: R8.1 SENSORIN.8
N$14
  Top 0.61: R20.2 14.22,19.05 14.99,19.81 19.56,19.81 T14.3
N$15
  Bottom 0.813: 96.5,14.71 S6.1
  Bottom 1.016: J5.1 85.8,3.9 88.5,1.2 94.9,1.2 96.5,2.8 96.5,14.71
N$16
  Bottom 0.813: SENSORIN.2 6.1,60.96 R6.1
N$28
  Top 0.813: T14.2 24.77,19.68 R22.1
N$29
  Top 0.61: T13.2 18.16,18.41 20.32,16.26 25.65,16.26 R23.1
N$30
  Top 0.813: T12.2 24.77,14.61 R24.1
N$31
  Top 0.61: T11.2 18.67,13.34 21.08,10.92 25.91,10.92 R25.1
N$32
  Top 0.813: T10.2 24.77,9.53 R26.1
N$33
  Top 0.61: T9.2 18.41,8.26 20.83,5.84 25.91,5.84 R27.1
N$34
  Top 0.813: T8.2 24.77,4.45 R28.1
N$35
  Bottom 0.406: R29.1 62.74,16.51 63.5,15.75 T17.2
N$36
  Bottom 0.813: T17.3 64.77,20.07 63.75,21.08 R30.1
N$37
  Bottom 0.813: R31.1 63.25,5.33 T18.3
N$38
  Bottom 0.406: T18.2 61.21,11.94 60.45,12.7 60.45,16.76 R32.1
N$39
  Top 0.61: LED3.K 82.04,21.34 R33.2
N$40
  Top 0.813: LED1.K 70.1,20.83 67.82,20.83 R30.2
N$41
  Top 0.813: R31.2 68.07,3.05 64.52,6.6 LED2.K
ON_BOARDSS1
  Bottom 0.61: SEVENSEG.2 6.86,4.57 R21.1
ON_BOARDSS2
  Bottom 0.61: SEVENSEG.3 6.86,7.11 R15.1
ON_BOARDSS3
  Bottom 0.61: SEVENSEG.4 6.86,9.65 R16.1
ON_BOARDSS4
  Bottom 0.61: SEVENSEG.5 6.86,12.19 R17.1
ON_BOARDSS5
  Bottom 0.61: SEVENSEG.6 6.86,14.73 R18.1
ON_BOARDSS6
  Bottom 0.61: SEVENSEG.7 6.86,17.27 R19.1
ON_BOARDSS7
  Bottom 0.61: SEVENSEG.8 6.86,19.81 R20.1
RST
  Bottom 0.406: 61.98,76.2 66.04,76.2
  Bottom 0.61: J1.1 60.71,77.47 61.98,76.2 | J3.1 85.09,76.2 66.04,76.2
SEN1
  Bottom 0.813: R8.2 12.7,77.47 15.11,77.47 T7.2
SEN2
  Top 0.61: R1.2 11.68,73.91 15.75,73.91 18.8,70.87 20.45,70.87 T6.2
SEN3
  Bottom 0.813: R2.2 11.68,71.12 13.21,72.64 15.11,72.64 T5.2
SEN4
  Top 0.61: R3.2 13.46,68.58 17.02,65.02 18.92,65.02 T4.2
SEN5
  Bottom 0.813: R4.2 13.59,66.04 T3.2
SEN6
  Top 0.61: R5.2 11.43,63.25 13.97,60.71 13.97,59.44 16.76,56.64 18.16,56.64 T2.2
SEN7
  Top 0.61: R6.2 T1.2
SLEEP
  Top 0.406: MOTOR_DRIVER.4 94.74,69.34 93.98,68.58 93.98,65.28 90.42,61.72 90.42,31.5 88.14,29.21 J3.20
  Bottom 0.406: J3.20 86.36,28.7 78.74,21.08 73.91,21.08 69.34,16.51 R29.2
SLEEP_GENERATED
  Bottom 0.813: J1.20 J4.20
SO1
  Top 0.406: T7.3 14.99,75.44 17.02,77.47 20.07,77.47 R14.1
  Top 0.61: 49.78,69.85 50.04,69.85 51.31,71.12 62.23,71.12 J4.4
  Top 0.813: J2.4 49.78,69.85
  Bottom 0.813: R14.1 J2.4
SO2
  Top 0.61: T6.3 22.8,72.9 25.69,70 25.69,67.97 26.35,67.31 R13.1 | 49.78,67.31 50.04,67.31 51.31,68.58 55.63,68.58 56.9,67.31 J4.5
  Top 0.813: J2.5 49.78,67.31
  Bottom 0.813: R13.1 J2.5
SO3
  Top 0.61: R12.1 25.4,64.77 24.13,66.04 24.13,68.07 23.62,68.58 16,68.58 T5.3 | 51.82,66.04 62.23,66.04 J4.6
  Top 0.813: J2.6 32.26,64.77 33.53,66.04 51.82,66.04
  Bottom 0.813: R12.1 J2.6
SO4
  Top 0.61: T4.3 20.32,65.02 21.84,63.5 25.4,63.5 26.67,62.23 R11.1 | 50.29,62.23 51.56,63.5 62.23,63.5 J4.7
  Top 0.813: J2.7 31.5,62.23 34.04,59.69 47.75,59.69 50.29,62.23
  Bottom 0.813: R11.1 J2.7
SO5
  Top 0.406: R10.1 27.18,59.69 25.91,60.96 15.49,60.96 T3.3
  Top 0.61: 49.78,59.69 50.04,59.94 51.05,60.96 62.23,60.96 J4.8
  Top 0.813: J2.8 32.26,59.69 33.53,58.42 48.51,58.42 50.04,59.94
  Bottom 0.813: J2.8 R10.1
SO6
  Top 0.61: T2.3 19.81,58.42 26.42,58.42 R9.2 | 49.28,57.15 49.53,57.15 50.8,58.42 62.23,58.42 J4.9
  Top 0.813: J2.9 49.28,57.15
  Bottom 0.813: J2.9 R9.2
SO7
  Top 0.61: T1.3 15.24,55.37 20.83,55.37 21.34,55.88 26.42,55.88 R7.1 | 49.78,54.61 50.04,54.61 51.31,55.88 62.23,55.88 J4.10
  Top 0.813: R7.1 49.78,54.61
  Bottom 0.813: R7.1 J2.10
SOFTRST
  Bottom 0.813: J1.10 59.69,54.61 60.96,53.59 60.96,38.1 62.23,36.83 J4.17
SS1
  Bottom 0.406: R28.2 35.05,2.54 36.07,3.56 36.07,12.95 38.61,15.49 44.7,15.49 48.77,19.56 48.77,37.08 51.05,39.37 J1.16
SS2
  Bottom 0.406: J1.15 52.07,41.91 47.75,37.59 47.75,19.81 44.2,16.26 38.1,16.26 35.31,13.46 35.31,6.6 33.78,5.08 R27.2
SS3
  Bottom 0.406: R26.2 33.53,7.62 34.54,8.64 34.54,13.72 37.85,17.02 43.69,17.02 46.74,20.07 46.74,40.13 51.05,44.45 J1.14
SS4
  Bottom 0.406: R25.2 32.77,10.16 33.78,11.18 33.78,13.97 37.59,17.78 43.18,17.78 45.72,20.32 45.72,41.66 51.05,46.99 J1.13
SS5
  Bottom 0.406: R24.2 31.75,12.95 37.34,18.54 42.67,18.54 44.96,20.83 44.96,43.94 50.55,49.53 J1.12
SS6
  Bottom 0.406: R23.2 32.77,15.24 36.83,19.3 42.16,19.3 44.2,21.34 44.2,48.01 48.26,52.07 J1.11
SS7
  Bottom 0.406: R22.2 34.29,17.78 36.58,20.07 41.66,20.07 43.18,21.59 43.18,51.56 48.77,57.15 J1.9
VCC
  Top 0.406: 60.96,68.83 61.47,68.58 65.79,68.58 | 32.77,53.34 26.67,53.34
  Top 0.813: 71.88,26.92 71.88,67.31 | 71.88,67.31 74.42,69.85 J3.4 | 60.96,68.83 59.44,69.85 J1.4 | 65.79,68.58 70.61,68.58 71.88,67.31 | 32.77,53.34 46.23,53.34 48.01,51.56 48.01,29.72 50.8,26.92 70.1,26.92 | 26.67,53.34 25.4,54.61 R7.2 | C3.+ 74.68,22.35 LED1.A | 70.1,26.92 LED1.A | LED1.A 71.88,26.92 | 71.88,26.92 70.87,26.92 | 70.1,26.92 70.87,26.92 | 70.87,26.92 71.37,26.42
  Bottom 0.406: 20.07,2.03 20.83,1.27 64.77,1.27 65.79,2.29
  Bottom 0.61: JP1.1 92.71,48.01 91.69,46.99 91.69,42.16 | 91.69,42.16 91.69,35.31 | 91.69,35.31 91.69,29.97 86.87,25.15 86.87,22.35 86.11,21.59 80.77,21.59 79.5,20.32 75.69,20.32 C3.+ | JP2.1 91.95,41.91 91.69,42.16 | JP3.1 91.95,35.56 91.69,35.31
  Bottom 0.813: R14.2 R13.2 R12.2 R11.2 R10.2 R9.1 R7.2 | IC1.2 75.44,6.1 75.18,6.35 C1.1 74.68,13.46 C3.+ 66.99,11.11 67.06,11.04 LED2.A 67,8.83 67,7.6 65.79,6.39 65.79,2.29 | SEVENSEG.1 20.07,2.03
  pour Bottom: 75.18,12.7 75.18,14.99 73.15,17.02 73.15,18.8 74.42,20.07 74.68,20.32 76.2,20.32 76.71,19.81 76.71,13.97 75.44,12.7

### Text on the board
tPlace: GND | GND | GND | 3.3v | GND | 3.3v | 3.3v | GND | 3.3v | 3.3v | 3.3v | GND | HEAT SINK | 3.3v
tNames: TTU / ELEVATOR / LAB / VER. 1